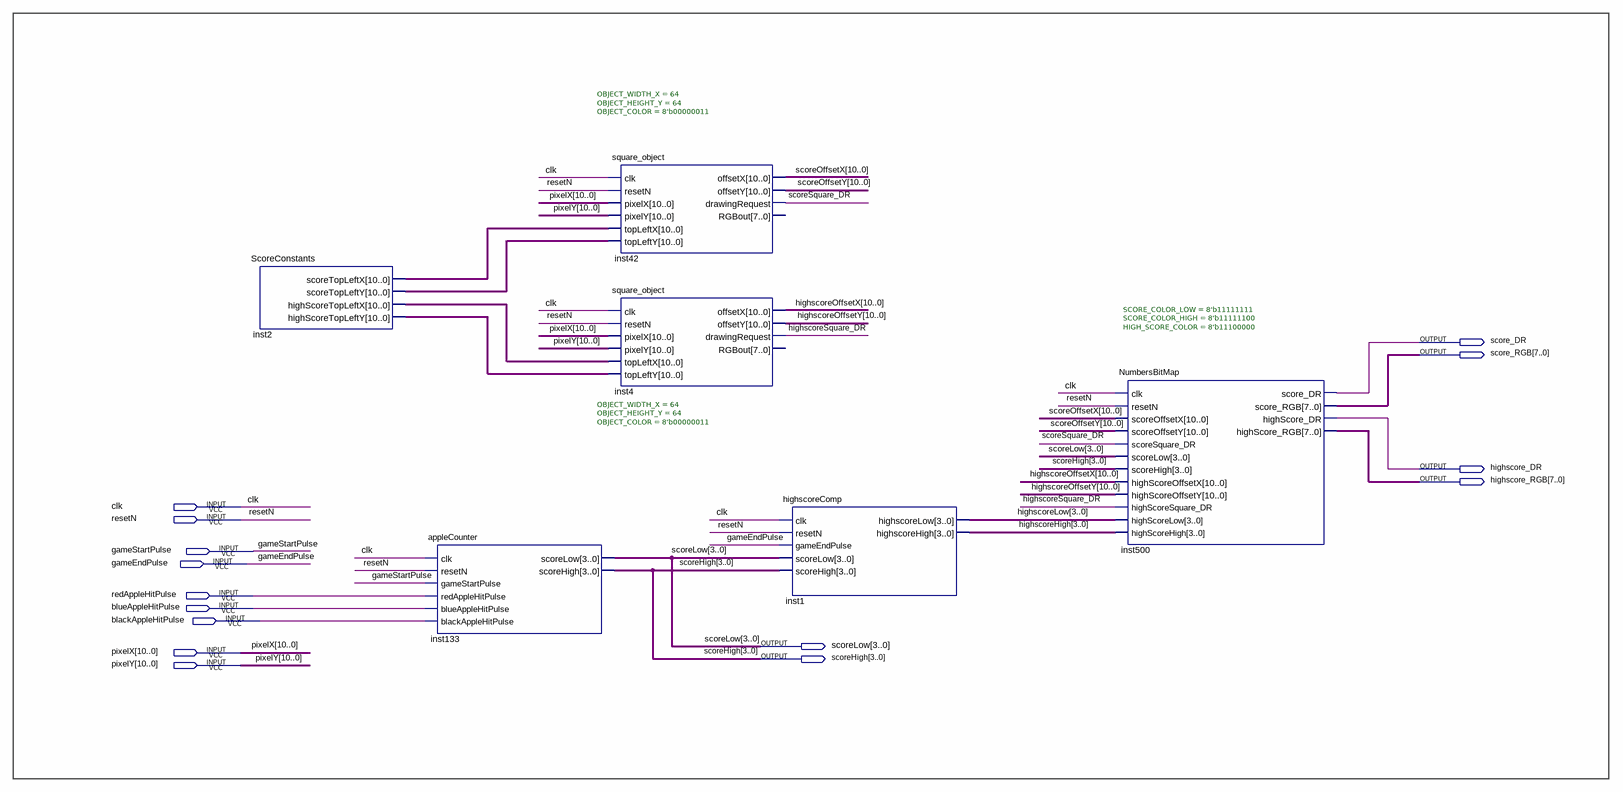
[diagram p0: schematic sheet]
// Quartus schematic Score_Block.bdf as structural Verilog: 6 symbols, 15 pins
module Score_Block (
  input  clk,
  input  resetN,
  input  gameStartPulse,
  input  gameEndPulse,
  input  redAppleHitPulse,
  input  blueAppleHitPulse,
  input  blackAppleHitPulse,
  input  [10:0] pixelX,
  input  [10:0] pixelY,
  output score_DR,
  output [7:0] score_RGB,
  output highscore_DR,
  output [7:0] highscore_RGB,
  output [3:0] scoreLow,
  output [3:0] scoreHigh
);

  wire highscoreSquare_DR, scoreSquare_DR;
  wire [3:0] highscoreHigh, highscoreLow;
  wire [10:0] highscoreOffsetX, highscoreOffsetY, inst2_highscoretopleftx, inst2_highscoretoplefty,
       inst2_scoretopleftx, inst2_scoretoplefty, scoreOffsetX, scoreOffsetY;

  ScoreConstants inst2 (
    .scoreTopLeftX(inst2_scoretopleftx), .scoreTopLeftY(inst2_scoretoplefty),
    .highScoreTopLeftX(inst2_highscoretopleftx), .highScoreTopLeftY(inst2_highscoretoplefty));
  appleCounter inst133 (
    .clk(clk), .resetN(resetN), .gameStartPulse(gameStartPulse), .redAppleHitPulse(redAppleHitPulse),
    .blueAppleHitPulse(blueAppleHitPulse), .blackAppleHitPulse(blackAppleHitPulse), .scoreLow(scoreLow),
    .scoreHigh(scoreHigh));
  square_object #(.OBJECT_WIDTH_X(64), .OBJECT_HEIGHT_Y(64), .OBJECT_COLOR(8'b00000011)) inst42 (
    .clk(clk), .resetN(resetN), .pixelX(pixelX), .pixelY(pixelY), .topLeftX(inst2_scoretopleftx),
    .topLeftY(inst2_scoretoplefty), .offsetX(scoreOffsetX), .offsetY(scoreOffsetY),
    .drawingRequest(scoreSquare_DR));  // open: RGBout
  square_object #(.OBJECT_WIDTH_X(64), .OBJECT_HEIGHT_Y(64), .OBJECT_COLOR(8'b00000011)) inst4 (
    .clk(clk), .resetN(resetN), .pixelX(pixelX), .pixelY(pixelY), .topLeftX(inst2_highscoretopleftx),
    .topLeftY(inst2_highscoretoplefty), .offsetX(highscoreOffsetX), .offsetY(highscoreOffsetY),
    .drawingRequest(highscoreSquare_DR));  // open: RGBout
  highscoreComp inst1 (
    .clk(clk), .resetN(resetN), .gameEndPulse(gameEndPulse), .scoreLow(scoreLow), .scoreHigh(scoreHigh),
    .highscoreLow(highscoreLow), .highscoreHigh(highscoreHigh));
  NumbersBitMap #(.SCORE_COLOR_LOW(8'b11111111), .SCORE_COLOR_HIGH(8'b11111100), .HIGH_SCORE_COLOR(8'b11100000)) inst500 (
    .clk(clk), .resetN(resetN), .scoreOffsetX(scoreOffsetX), .scoreOffsetY(scoreOffsetY),
    .scoreSquare_DR(scoreSquare_DR), .scoreLow(scoreLow), .scoreHigh(scoreHigh),
    .highScoreOffsetX(highscoreOffsetX), .highScoreOffsetY(highscoreOffsetY),
    .highScoreSquare_DR(highscoreSquare_DR), .highScoreLow(highscoreLow), .highScoreHigh(highscoreHigh),
    .score_DR(score_DR), .score_RGB(score_RGB), .highScore_DR(highscore_DR), .highScore_RGB(highscore_RGB));
endmodule
